# EAGLE schematic VM Cut Off (EAGLE 6.3)
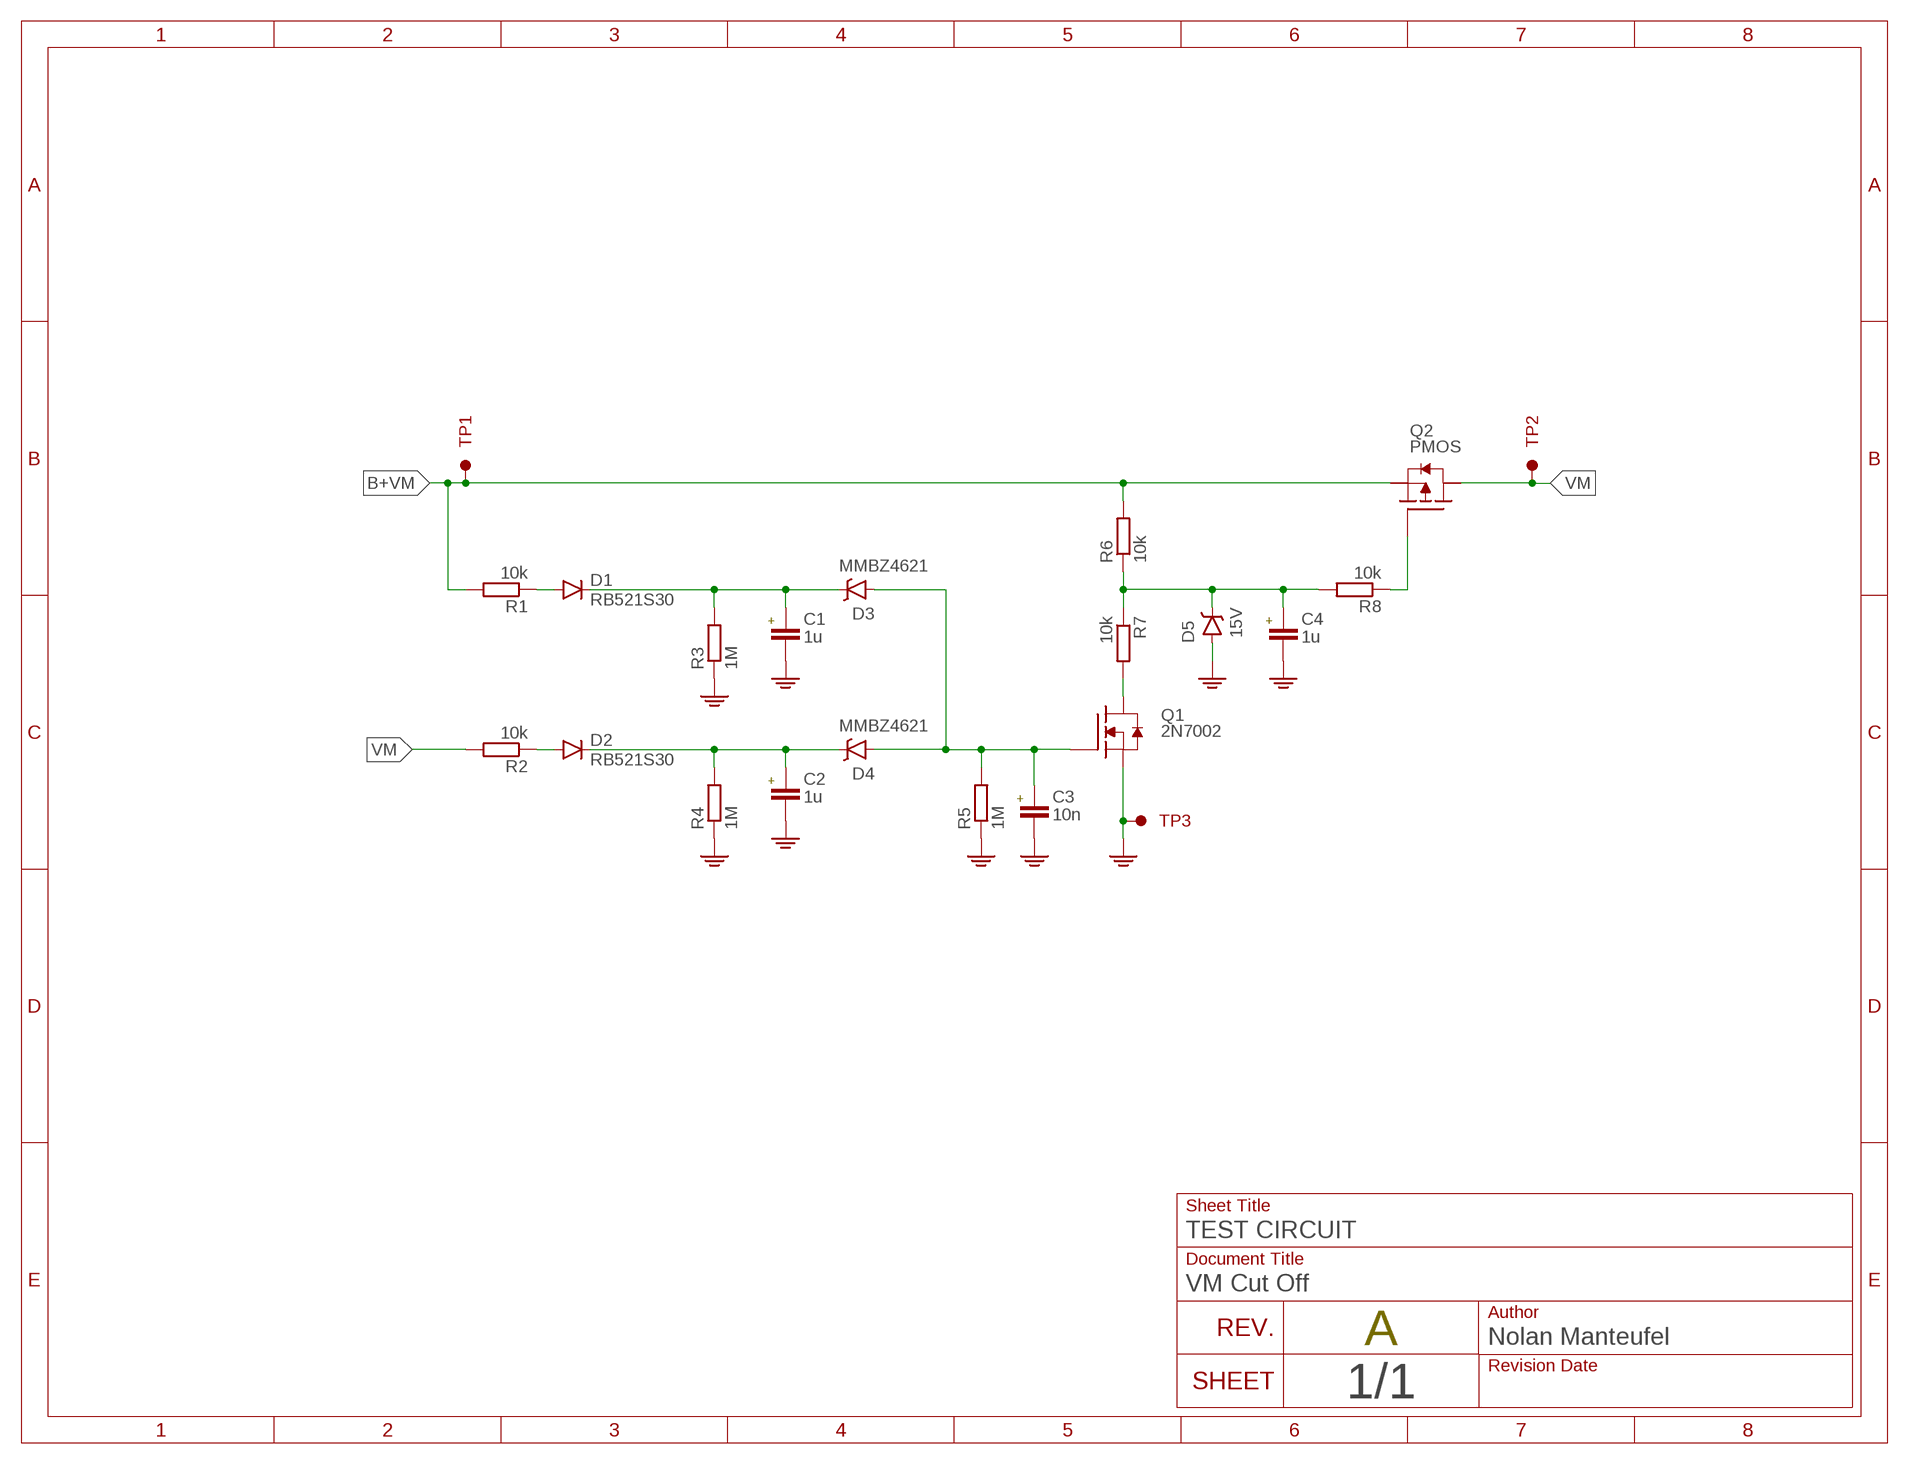
[diagram p0: schematic, sheet 1]

## Parts
C1  1u  C-EUC0402  [C0402]
C2  1u  C-EUC0402  [C0402]
C3  10n  C-EUC0402  [C0402]
C4  1u  C-EUC0402  [C0402]
D1  RB521S30  DIODE-SC79_INFINEON  [SC79_INFINEON]
D2  RB521S30  DIODE-SC79_INFINEON  [SC79_INFINEON]
D3  MMBZ4621  ZENER-DIODESOT23  [SOT23]
D4  MMBZ4621  ZENER-DIODESOT23  [SOT23]
D5  15V  ZENER-DIODESOT23  [SOT23]
Q1  2N7002  MOSFET-NSOT23  [SOT23]
Q2  PMOS  MOSFET-PNTR2101PT1G  [SOT23]
R1  10k  R-EU_R0402  [R0402]
R2  10k  R-EU_R0402  [R0402]
R3  1M  R-EU_R0402  [R0402]
R4  1M  R-EU_R0402  [R0402]
R5  1M  R-EU_R0402  [R0402]
R6  10k  R-EU_R0402  [R0402]
R7  10k  R-EU_R0402  [R0402]
R8  10k  R-EU_R0402  [R0402]
TP1  PWR  TESTPOINTKE5000-SMTEXT  [PINS_1_TESTPOINT_KE5000_NOTEXT]
TP2  OUT  TESTPOINTKE5000-SMTEXT  [PINS_1_TESTPOINT_KE5000_NOTEXT]
TP3  GND  TESTPOINTKE5000-SMTEXT  [PINS_1_TESTPOINT_KE5000_NOTEXT]

## Nets
B+VM: Q2.3(S) R1.2 R6.2 TP1.1
GND: C1.2 C2.2 C3.2 C4.2 D5.1(A) Q1.2(S) R3.1 R4.1 R5.1 TP3.1
N$1: Q1.3(D) R7.2
N$2: Q2.1(G) R8.1
N$3: C4.1 D5.3(C) R6.1 R7.1 R8.2
N$4: C3.1 D3.1(A) D4.1(A) Q1.1(G) R5.2
N$5: C1.1 D1.C D3.3(C) R3.2
N$6: D2.A R2.1
N$7: D1.A R1.1
N$8: C2.1 D2.C D4.3(C) R4.2
VM: Q2.2(D) R2.2 TP2.1

## Library data of the parts
C1-C4 = nolan:C-EU: CAPACITOR, European symbol
D1 D2 = nolan:DIODE-: DIODE
D3-D5 = nolan:ZENER-DIODE: Z-Diode
Q1 = nolan:MOSFET-N
Q2 = nolan:MOSFET-P
R1-R8 = nolan:R-EU_: RESISTOR, European symbol
TP1-TP3 = nolan:TESTPOINT